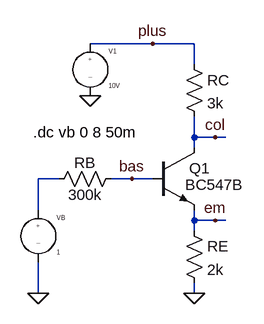
[diagram p0: schematic UK_17.asc]
UK_17.asc, the LTspice schematic file:
Version 4
SHEET 1 880 680
WIRE 208 -16 112 -16
WIRE 272 -16 208 -16
WIRE 272 16 272 -16
WIRE 272 128 272 96
WIRE 304 128 272 128
WIRE 320 128 304 128
WIRE 272 144 272 128
WIRE 64 192 32 192
WIRE 176 192 144 192
WIRE 208 192 176 192
WIRE 32 240 32 192
WIRE 272 256 272 240
WIRE 304 256 272 256
WIRE 320 256 304 256
WIRE 272 272 272 256
WIRE 32 368 32 320
WIRE 272 368 272 352
FLAG 272 368 0
FLAG 176 192 bas
FLAG 304 128 col
FLAG 304 256 em
FLAG 32 368 0
FLAG 208 -16 plus
FLAG 112 64 0
SYMBOL EIT_Semiconductors\\npn 208 144 R0
WINDOW 3 50 57 Left 2
SYMATTR Value BC547B
SYMATTR InstName Q1
SYMBOL res 256 256 R0
SYMATTR InstName RE
SYMATTR Value 2k
SYMBOL res 256 0 R0
SYMATTR InstName RC
SYMATTR Value 3k
SYMBOL res 48 208 R270
WINDOW 0 25 56 VTop 2
WINDOW 3 7 56 VBottom 2
SYMATTR InstName RB
SYMATTR Value 300k
SYMBOL source-V 32 224 R0
SYMATTR InstName VB
SYMATTR Value 1
SYMBOL source-V 112 -32 R0
SYMATTR InstName V1
SYMATTR Value 10V
TEXT 24 120 Left 2 !.dc vb 0 8 50m

The netlist it stands for:
* UK_17.asc
Q1 col bas em 0 BC547B
RE em 0 2k
RC plus col 3k
RB N001 bas 300k
VB N001 0 1
V1 plus 0 10V
.model NPN NPN
.model PNP PNP
.lib standard.bjt
.dc vb 0 8 50m
.backanno
.end